# EAGLE design generic_maxi_1 (EAGLE 6.4)
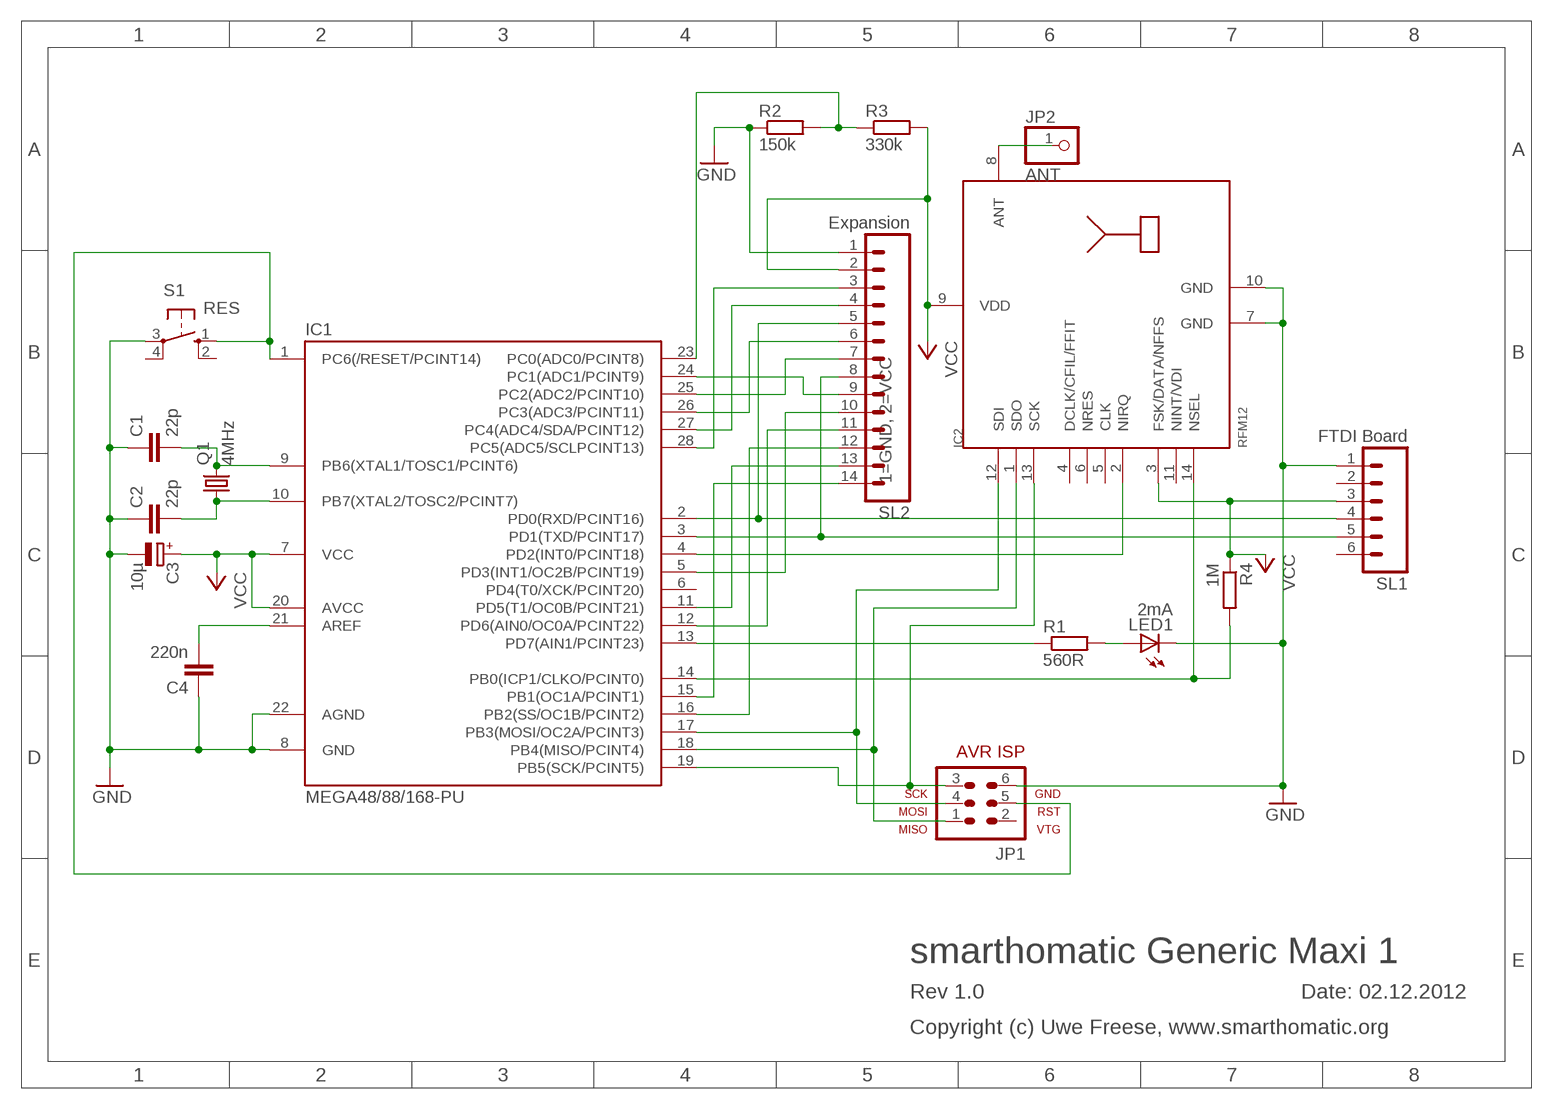
[diagram p0: schematic, sheet 1]

## Parts
C1  22p  C-EU025-024X044  [C025-024X044]
C2  22p  C-EU025-024X044  [C025-024X044]
C3  10µ  CPOL-EUE1.8-4  [E1,8-4]
C4  220n  C-EU025-030X050  [C025-030X050]
IC1  MEGA48/88/168-PU  [DIL28-3]
IC2  RFM12  [RFM]
JP1  AVR-ISP-6  [AVR-ISP-6]
JP2  ANT  PINHD-1X1  [1X01]
LED1  2mA  LED3MM  [LED3MM]
Q1  4MHz  CRYSTALHC49S  [HC49/S]
R1  560R  R-EU_0207/7  [0207/7]
R2  150k  R-EU_0207/7  [0207/7]
R3  330k  R-EU_0207/7  [0207/7]
R4  1M  R-EU_0207/7  [0207/7]
S1  RES  10-XX  [B3F-10XX]
SL1  FTDI Board  M06  [06P]
SL2  Expansion  M14  [14P]

## Nets
GND: C1.1 C2.1 C3.- C4.1 IC1.8(GND) IC1.22(AGND) IC2.7(GND) IC2.10(GND) JP1.6 LED1.K(C) R2.1 S1.3(P) SL1.1 SL2.1
N$1: C1.2 IC1.9(PB6(XTAL1/TOSC1/PCINT6)) Q1.2
N$2: C2.2 IC1.10(PB7(XTAL2/TOSC2/PCINT7)) Q1.1
N$3: IC1.17(PB3(MOSI/OC2A/PCINT3)) IC2.12(SDI) JP1.4
N$4: IC1.18(PB4(MISO/PCINT4)) IC2.1(SDO) JP1.1
N$5: IC1.19(PB5(SCK/PCINT5)) IC2.13(SCK) JP1.3
N$6: IC1.27(PC4(ADC4/SDA/PCINT12)) SL2.4
N$7: IC1.28(PC5(ADC5/SCLPCINT13)) SL2.3
N$8: IC1.1(PC6(/RESET/PCINT14)) JP1.5 S1.1(S)
N$9: IC1.3(PD1(TXD/PCINT17)) SL1.5 SL2.8
N$10: IC1.2(PD0(RXD/PCINT16)) SL1.4 SL2.5
N$11: IC1.24(PC1(ADC1/PCINT9)) SL2.9
N$12: LED1.A R1.2
N$13: IC1.14(PB0(ICP1/CLKO/PCINT0)) IC2.14(NSEL) R4.2
N$14: IC1.25(PC2(ADC2/PCINT10)) SL2.7
N$15: IC1.4(PD2(INT0/PCINT18)) IC2.2(NIRQ)
N$16: IC1.26(PC3(ADC3/PCINT11)) SL2.6
N$17: IC1.5(PD3(INT1/OC2B/PCINT19)) SL2.10
N$18: IC1.23(PC0(ADC0/PCINT8)) R2.2 R3.1
N$19: IC1.11(PD5(T1/OC0B/PCINT21)) SL2.13
N$20: IC1.12(PD6(AIN0/OC0A/PCINT22)) SL2.11
N$21: IC1.13(PD7(AIN1/PCINT23)) R1.1
N$22: IC1.15(PB1(OC1A/PCINT1)) SL2.14
N$23: IC1.16(PB2(SS/OC1B/PCINT2)) SL2.12
N$24: C4.2 IC1.21(AREF)
N$25: IC2.8(ANT) JP2.1
VCC: C3.+ IC1.7(VCC) IC1.20(AVCC) IC2.3(FSK/DATA/NFFS) IC2.9(VDD) R3.2 R4.1 SL1.3 SL2.2
Unconnected: IC1.6(PD4(T0/XCK/PCINT20)) IC2.4(DCLK/CFIL/FFIT) IC2.5(CLK) IC2.6(NRES) IC2.11(NINT/VDI) JP1.2 S1.2(S1) S1.4(P1) SL1.2 SL1.6

## Notes on the sheet
- 1=GND, 2=VCC
- smarthomatic Generic Maxi 1
- Rev 1.0 | Date: 02.12.2012
- Copyright (c) Uwe Freese, www.smarthomatic.org

## Library data of the parts
C1 C2 C4 = rcl:C-EU: CAPACITOR, European symbol
C3 = rcl:CPOL-EU: POLARIZED CAPACITOR, European symbol
IC1 = avr-5-4.16:MEGA48/88/168-PU
IC2 = hopeRF:RFM12
JP1 = avr-5-4.16:AVR-ISP-6: AVR ISP-6 Serial Programming Header
JP2 = pinhead:PINHD-1X1: PIN HEADER
LED1 = led:LED: LED OSRAM: - CHIPLED LG R971, LG N971, LY N971, LG Q971, LY Q971, LO R971, LY R971 LH N974, LH R974 LS Q976, LO Q976, LY Q976 LO Q996 - Hyper CHIPLED LW Q18S LB Q993, LB Q99A, LB R99A - SideLED LS A670, LO A670, LY A670, LG A670, LP A670 LB A673, LV A673, LT A673, LW A673 LH A674 LY A675 LS A676, LA A676, LO A676, LY A676, LW A676 LS A679, LY A679, LG A679 - Hyper Micro SIDELED® LS Y876, LA Y876, LO Y876, LY Y876 LT Y87S - SmartLED LW L88C, LW L88S LB L89C, LB L89S, LG L890 LS L89K, LO L89K, LY L89K LS L896, LA L896, LO L896, LY L896 - TOPLED LS T670, LO T670, LY T670, LG T670, LP T670 LSG T670, LSP T670, LSY T670, LOP T670, LYG T670 LG T671, LOG T671, LSG T671 LB T673, LV T673, LT T673, LW T673 LH T674 LS T676, LA T676, LO T676, LY T676, LB T676, LH T676, LSB T676, LW T676 LB T67C, LV T67C, LT T67C, LS T67K, LO T67K, LY T67K, LW E67C LS E67B, LA E67B, LO E67B, LY E67B, LB E67C, LV E67C, LT E67C LW T67C LS T679, LY T679, LG T679 LS T770, LO T770, LY T770, LG T770, LP T770 LB T773, LV T773, LT T773, LW T773 LH T774 LS E675, LA E675, LY E675, LS T675 LS T776, LA T776, LO T776, LY T776, LB T776 LHGB T686 LT T68C, LB T68C - Hyper Mini TOPLED® LB M676 - Mini TOPLED Santana® LG M470 LS M47K, LO M47K, LY M47K Source: http://www.osram.convergy.de LUXEON: - LUMILED® LXK2-PW12-R00, LXK2-PW12-S00, LXK2-PW14-U00, LXK2-PW14-V00 LXK2-PM12-R00, LXK2-PM12-S00, LXK2-PM14-U00 LXK2-PE12-Q00, LXK2-PE12-R00, LXK2-PE12-S00, LXK2-PE14-T00, LXK2-PE14-U00 LXK2-PB12-K00, LXK2-PB12-L00, LXK2-PB12-M00, LXK2-PB14-N00, LXK2-PB14-P00, LXK2-PB14-Q00 LXK2-PR12-L00, LXK2-PR12-M00, LXK2-PR14-Q00, LXK2-PR14-R00 LXK2-PD12-Q00, LXK2-PD12-R00, LXK2-PD12-S00 LXK2-PH12-R00, LXK2-PH12-S00 LXK2-PL12-P00, LXK2-PL12-Q00, LXK2-PL12-R00 Source: www.luxeon.com KINGBRIGHT: KA-3528ASYC Source: www.kingbright.com
Q1 = crystal:CRYSTAL: CRYSTAL; OC_FARNELL: 1667008; OC_NEWARK: unknown
R1-R4 = rcl:R-EU_: RESISTOR, European symbol
S1 = switch-omron:10-XX: OMRON SWITCH; MPN: B3F-1000; OC_FARNELL: 176432; OC_NEWARK: 36M3542
SL1 = con-amp-quick:M06: AMP QUICK CONNECTOR; OC_FARNELL: unknown; OC_NEWARK: unknown
SL2 = con-amp-quick:M14: AMP QUICK CONNECTOR; OC_FARNELL: unknown; OC_NEWARK: unknown

## Board
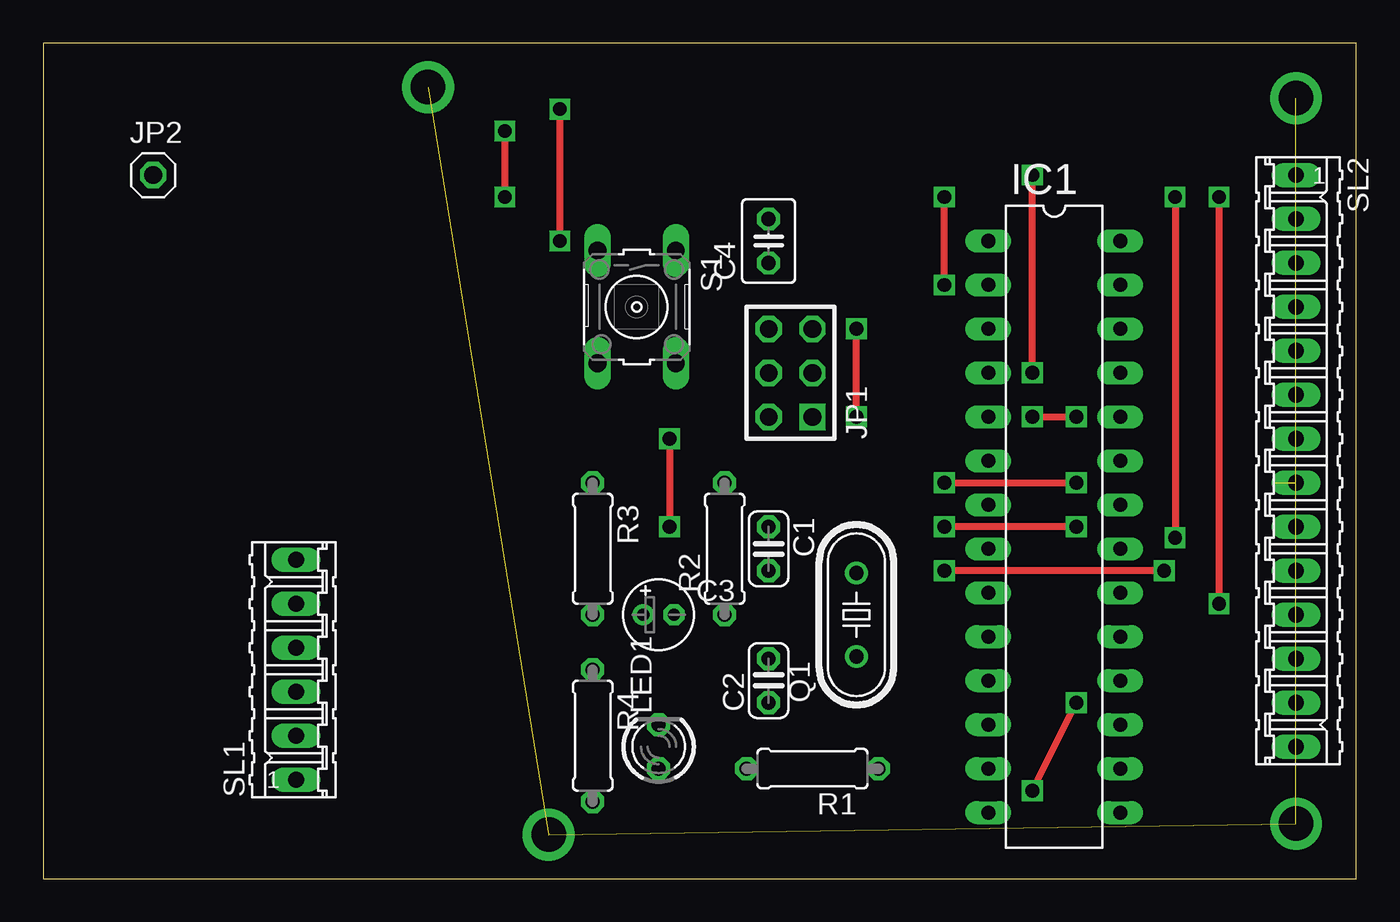
[diagram p1: board, top side]
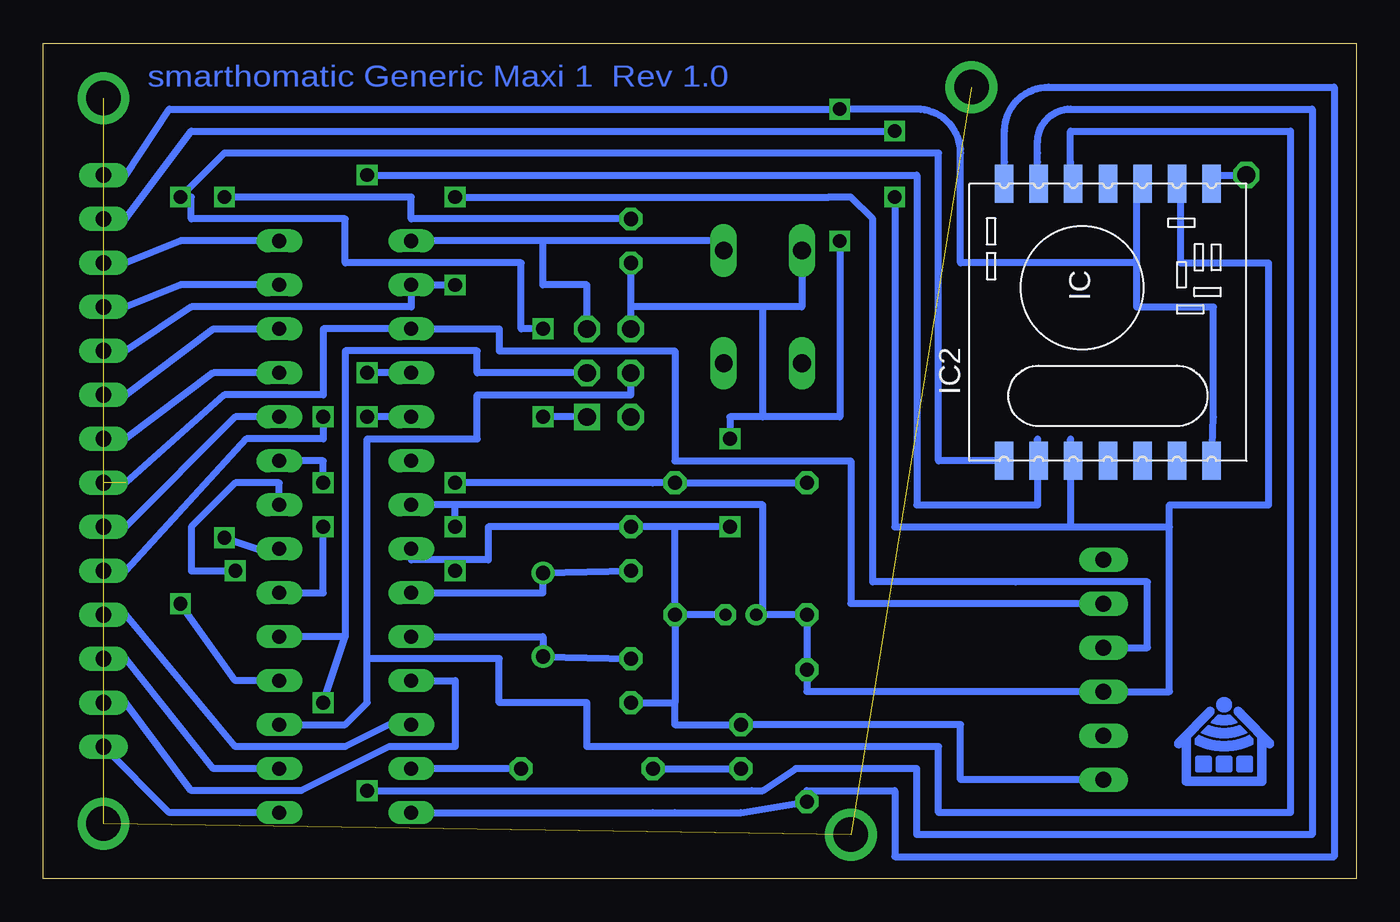
[diagram p2: board, bottom side, seen from below]

Size 75.87 x 48.25 mm. Coordinates in mm from the lower left corner, seen from the top.
Outline: 0,0 75.87,0 75.87,48.25 0,48.25 0,0
Copper layers (1*16): Top 0.035mm / dielectric 1.5mm / Bottom 0.035mm
Design rules "default": minimum track width 10mil, minimum drill 0.8mm, track to track 8mil, track to pad 8mil, pad to pad 8mil, via to via 8mil, smd to smd 8mil, copper to edge 40mil, drill to drill 8mil, minimum pad ring 10mil, minimum via ring 8mil, stop-mask expansion 4mil, vias tented up to drill 0mil, thermal gap 10mil

### Footprints (pad centres in the part's own frame; a part is rotated, then mirrored left to right if it is on the bottom)
C025-024X044 = drill 0.813 octagon: 1 -1.27,0; 2 1.27,0
E1,8-4 = drill 0.711 pad 1.168: + -0.889,0 | drill 0.711 pad 1.168 octagon: - 0.889,0
C025-030X050 = drill 0.813 octagon: 1 -1.27,0; 2 1.27,0
DIL28-3 = drill 0.813 long: 1 -16.51,-3.81; 2 -13.97,-3.81; 3 -11.43,-3.81; 4 -8.89,-3.81; 5 -6.35,-3.81; 6 -3.81,-3.81; 7 -1.27,-3.81; 8 1.27,-3.81; 9 3.81,-3.81; 10 6.35,-3.81; 11 8.89,-3.81; 12 11.43,-3.81; 13 13.97,-3.81; 14 16.51,-3.81; 15 16.51,3.81; 16 13.97,3.81; 17 11.43,3.81; 18 8.89,3.81; 19 6.35,3.81; 20 3.81,3.81; 21 1.27,3.81; 22 -1.27,3.81; 23 -3.81,3.81; 24 -6.35,3.81; 25 -8.89,3.81; 26 -11.43,3.81; 27 -13.97,3.81; 28 -16.51,3.81
RFM = smd 2.184 x 1.067: 1 0,14; 2 0,12; 3 0,10; 4 0,8; 5 0,6; 6 0,4; 7 0,2; 8 16,2; 9 16,4; 10 16,6; 11 16,8; 12 16,10; 13 16,12; 14 16,14
AVR-ISP-6 = drill 1.016 square: 1 -2.54,-1.27 | drill 1.016 octagon: 2 -2.54,1.27; 3 0,-1.27; 4 0,1.27; 5 2.54,-1.27; 6 2.54,1.27
1X01 = drill 1.016 octagon: 1 0,0
LED3MM = drill 0.813 octagon: A -1.27,0; K 1.27,0
HC49/S = drill 0.813: 1 -2.413,0; 2 2.413,0
0207/7 = drill 0.813 octagon: 1 -3.81,0; 2 3.81,0
B3F-10XX = drill 1.016 long: 1 -3.251,2.261; 2 3.251,2.261; 3 -3.251,-2.261; 4 3.251,-2.261
06P = drill 0.914 long: 1 -6.35,0; 2 -3.81,0; 3 -1.27,0; 4 1.27,0; 5 3.81,0; 6 6.35,0
14P = drill 0.914 long: 1 -16.51,0; 2 -13.97,0; 3 -11.43,0; 4 -8.89,0; 5 -6.35,0; 6 -3.81,0; 7 -1.27,0; 8 1.27,0; 9 3.81,0; 10 6.35,0; 11 8.89,0; 12 11.43,0; 13 13.97,0; 14 16.51,0

### Placement (x,y rotation side)
C1  41.91,19.05 270 top
C2  41.91,11.43 90 top
C3  35.56,15.24 0 top
C4  41.91,36.83 90 top
IC1  58.42,20.32 270 top
IC2  6.35,24.13 90 bottom
JP1  43.18,29.21 90 top
JP2  6.35,40.64 0 top
LED1  35.56,7.62 90 top
Q1  46.99,15.24 90 top
R1  44.45,6.35 180 top
R2  39.37,19.05 90 top
R3  31.75,19.05 270 top
R4  31.75,8.25 270 top
S1  34.29,33.02 270 top
SL1  14.6,12.06 90 top
SL2  72.39,24.13 270 top

### Tracks (layer width: path | path; a pad name or v marks a point on that pad's centre or on a via)
GND  (via drill 0.8)
  Top 0.406: v36.2,25.4 v36.2,20.32 | v29.84,44.45 v29.84,36.83 | v64.77,17.78 v52.07,17.78
  Bottom 0.406: 52.07,18.42 50.16,18.42 50.16,20.32 C1.1 39.37,20.32 | 52.07,18.42 54.61,18.42 IC1.8 | C2.1 39.37,10.16 | 39.37,10.16 39.37,8.89 LED1.K 22.86,8.89 22.86,5.71 SL1.1 | JP1.6 41.91,33.02 | 41.91,33.02 C4.1 | S1.3 32.03,33.02 34.29,33.02 | 34.29,33.02 41.91,33.02 | v36.2,20.32 39.37,20.32 | 34.29,26.67 29.84,26.67 v29.84,36.83 | 34.29,26.67 34.29,33.02 | 34.29,26.67 36.2,26.67 v36.2,25.4 | SL2.1 71.12,40.64 68.58,44.45 v29.84,44.45 25.4,44.45 arc90 22.86,41.91 22.86,35.56 12.7,35.56 | IC2.7 8.26,26.67 8.26,33.02 12.7,33.02 12.7,35.56 | IC2.10 12.7,40.13 12.7,35.56 | IC1.22 62.23,22.86 64.77,22.86 67.31,20.32 67.31,17.78 v64.77,17.78 | v52.07,17.78 52.07,18.42 | R2.1 39.37,20.32 | R2.1 39.37,10.16 | C3.- R2.1
N$1
  Bottom 0.406: IC1.9 46.99,16.51 Q1.2 C1.2
N$2
  Bottom 0.406: IC1.10 46.99,13.97 Q1.1 C2.2
N$3
  Bottom 0.406: IC1.17 58.42,8.89 57.15,10.16 57.15,12.7 | 57.15,12.7 57.15,25.4 50.8,25.4 50.8,27.94 41.91,27.94 JP1.4 | 57.15,12.7 49.53,12.7 49.53,10.16 44.45,10.16 44.45,7.62 24.13,7.62 24.13,3.81 3.81,3.81 3.81,43.18 16.51,43.18 16.51,41.4 IC2.12
N$4  (via drill 0.8)
  Top 0.406: v46.99,26.67 v46.99,31.75 | v67.95,15.87 v67.95,39.37
  Bottom 0.406: JP1.1 v46.99,26.67 | v46.99,31.75 48.26,31.75 48.26,35.56 58.42,35.56 58.42,38.1 67.31,38.1 67.31,39.37 v67.95,39.37 65.41,41.91 48.26,41.91 24.13,41.91 24.13,24.13 IC2.1 | IC1.18 64.77,11.43 v67.95,15.87
N$5  (via drill 0.8)
  Top 0.406: v57.15,5.08 v59.69,10.16
  Bottom 0.406: JP1.3 50.8,29.21 50.8,30.48 58.42,30.48 58.42,13.97 | 58.42,13.97 IC1.19 | IC2.13 18.41,41.4 18.41,41.91 18.41,42.55 arc90 16.51,44.45 2.54,44.45 2.54,2.54 25.4,2.54 25.4,6.35 32.39,6.35 34.29,5.08 34.93,5.08 v57.15,5.08 | v59.69,10.16 58.42,13.97
N$6
  Bottom 0.406: IC1.27 67.95,34.29 71.12,33.02 SL2.4
N$7
  Bottom 0.406: SL2.3 71.12,35.56 67.95,36.83 IC1.28
N$8
  Bottom 0.406: JP1.5 44.45,34.29 46.99,34.29 46.99,36.83 | 46.99,36.83 IC1.1 | S1.1 36.55,36.83 46.99,36.83
N$9  (1 unrouted)
  Bottom 0.406: 71.12,22.86 65.41,27.94 59.69,27.94 59.69,31.75 IC1.3 49.53,31.75 49.53,30.48 39.37,30.48 39.37,24.13 34.29,24.13 29.21,24.13 29.21,15.87 SL1.5
N$10  (via drill 0.8)
  Top 0.406: v52.07,34.29 v52.07,39.37
  Bottom 0.406: v52.07,34.29 IC1.2 54.61,33.02 67.31,33.02 71.12,30.48 SL2.5 | v52.07,39.37 30.48,39.37 29.21,39.37 27.94,38.1 27.94,17.14 19.69,17.14 12.06,17.14 12.06,13.33 SL1.4
N$11
  Bottom 0.406: IC1.24 64.77,26.67 71.12,20.32 SL2.9
N$12
  Bottom 0.406: R1.2 LED1.A
N$13
  Bottom 0.406: IC1.14 40.64,3.81 39.37,3.81 35.56,3.81 R4.2 31.75,5.08 26.67,5.08 26.67,1.27 1.27,1.27 1.27,45.72 17.78,45.72 arc-90 20.32,43.18 20.32,41.4 IC2.14
N$14
  Bottom 0.406: IC1.25 66.04,29.21 71.12,25.4 SL2.7
N$15  (via drill 0.8)
  Top 0.406: v57.15,29.21 v57.15,40.64
  Bottom 0.406: IC1.4 v57.15,29.21 | v57.15,40.64 25.4,40.64 25.4,21.59 18.41,21.59 18.41,25.4 IC2.2
N$16
  Bottom 0.406: SL2.6 71.12,27.94 66.04,31.75 IC1.26
N$17  (via drill 0.8)
  Top 0.406: v57.15,26.67 v59.69,26.67
  Bottom 0.406: IC1.5 v57.15,26.67 | v59.69,26.67 59.69,25.4 64.14,25.4 71.12,17.78 SL2.10
N$18  (via drill 0.8)
  Top 0.406: v52.07,22.86 v59.69,22.86
  Bottom 0.406: v59.69,22.86 59.69,24.13 IC1.23 | v52.07,22.86 40.64,22.86 R2.2 R3.1
N$19
  Bottom 0.406: IC1.11 52.07,11.43 52.07,7.62 55.88,7.62 60.96,5.08 67.31,5.08 71.12,10.16 SL2.13
N$20
  Bottom 0.406: IC1.12 55.88,8.89 58.42,7.62 64.77,7.62 71.12,15.24 SL2.11
N$21
  Bottom 0.406: R1.1 IC1.13
N$22
  Bottom 0.406: IC1.15 68.58,3.81 SL2.14
N$23
  Bottom 0.406: IC1.16 66.04,6.35 71.12,12.7 SL2.12
N$24  (via drill 0.8)
  Top 0.406: v65.41,39.37 v65.41,19.68
  Bottom 0.406: C4.2 54.61,38.1 54.61,39.37 v65.41,39.37 | v65.41,19.68 63.5,19.05 IC1.21
N$25
  Bottom 0.406: IC2.8 8.35,40.64 JP2.1
N$26  (via drill 2)  (3 unrouted)
  other vias: 22.23,45.72 72.39,45.09 72.39,3.18 29.21,2.54
VCC  (via drill 0.8)
  Top 0.406: v26.67,43.18 v26.67,39.37 | v59.69,20.32 v52.07,20.32
  Bottom 0.406: 52.07,21.59 IC1.7 | 16.51,20.32 10.79,20.32 | 10.79,20.32 10.79,21.59 5.08,21.59 5.08,35.56 10.16,35.56 10.16,40.13 IC2.9 | v26.67,43.18 67.31,43.18 71.12,38.1 SL2.2 | IC2.3 16.51,25.4 16.51,20.32 | v26.67,39.37 26.67,20.32 16.51,20.32 | IC1.20 59.69,16.51 v59.69,20.32 | v52.07,20.32 52.07,21.59 | 10.79,20.32 10.79,10.79 SL1.3 31.75,10.79 R4.1 R3.2 C3.+ 34.29,15.24 34.29,21.59 52.07,21.59
(copper drawn outside any net)
  shapes: Bottom area x2425

### Text on the board
Bottom: smarthomatic Generic Maxi 1 Rev 1.0